# EAGLE design noisemaker_4-0 (EAGLE 8.0.2)
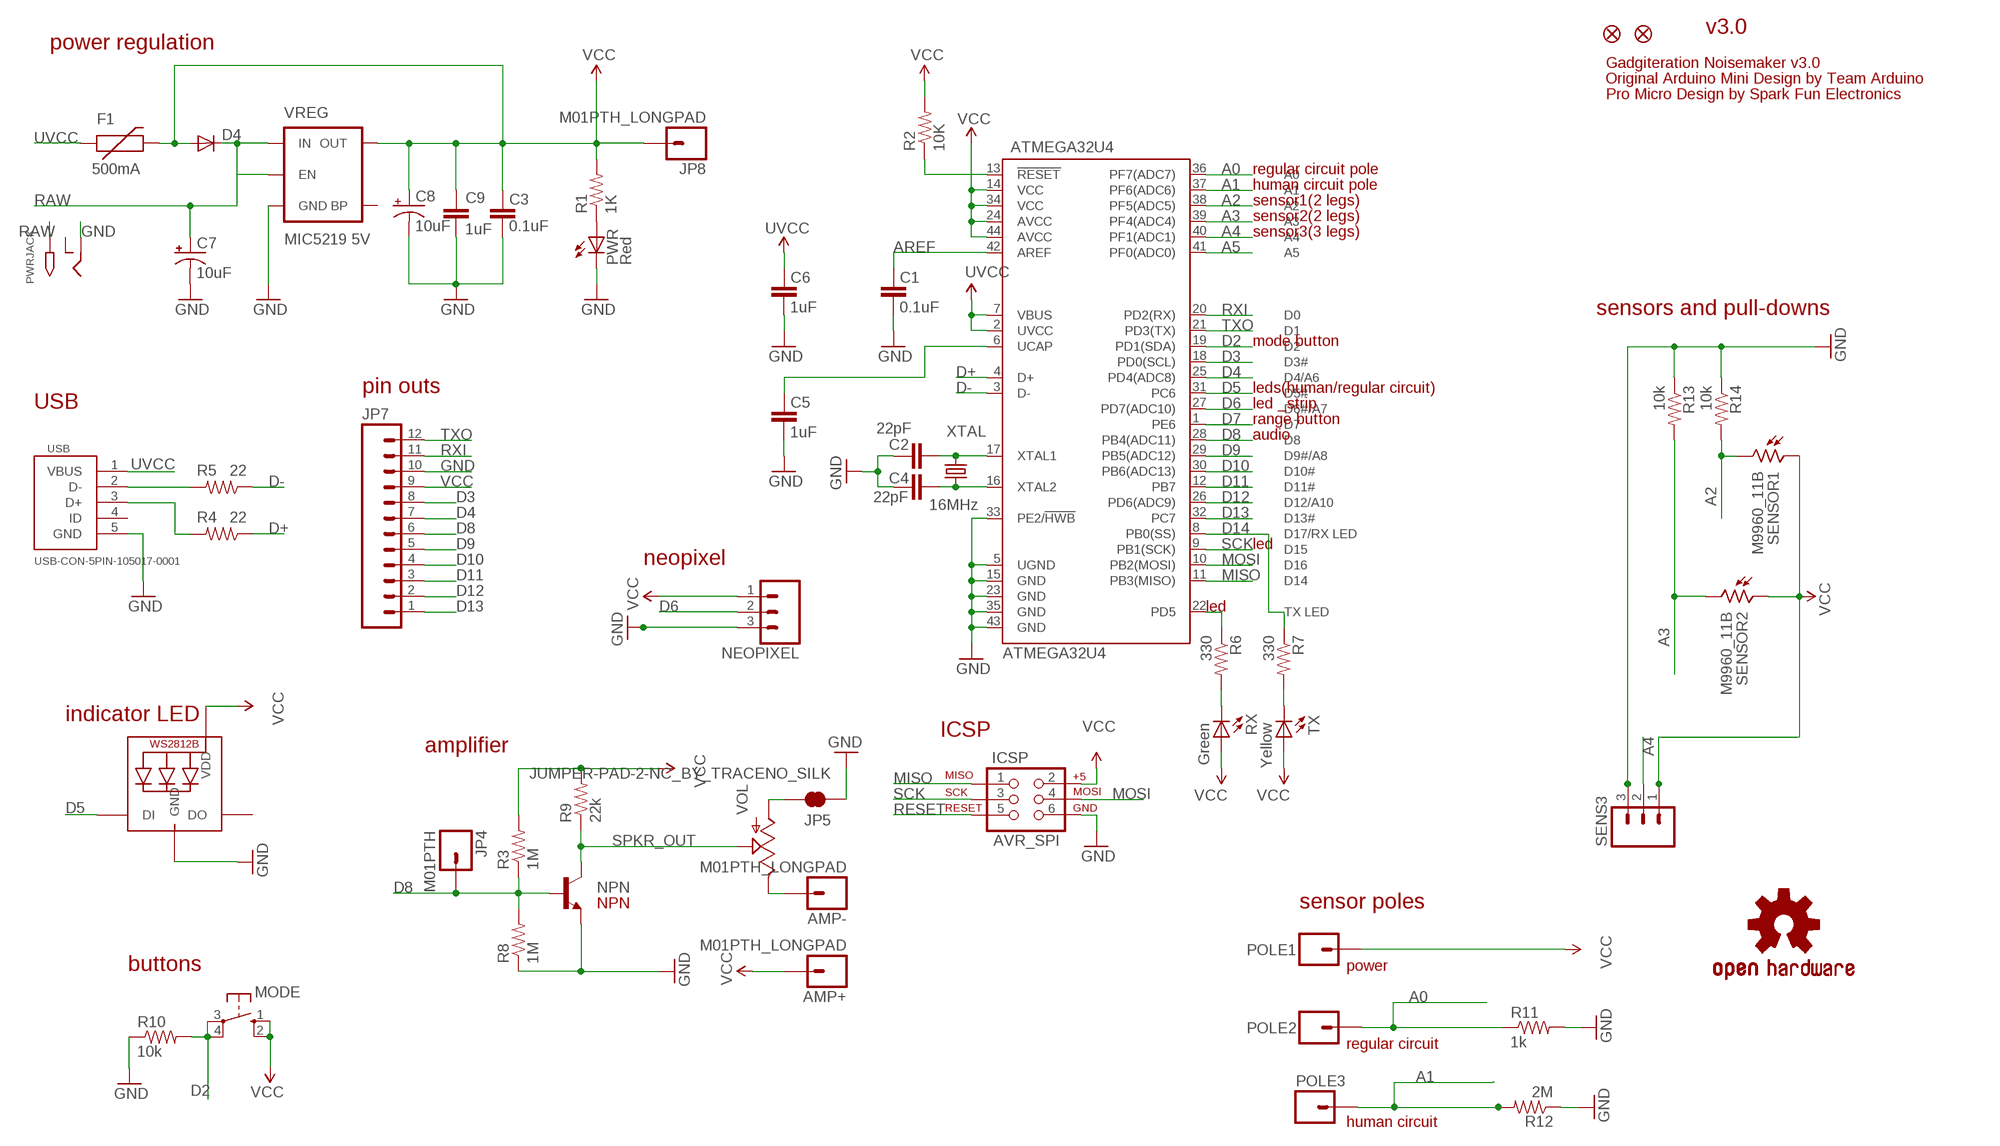
[diagram p0: schematic, sheet 1]

## Parts
AMP+  M01PTH_LONGPAD  [1X01_LONGPAD]
AMP-  M01PTH_LONGPAD  [1X01_LONGPAD]
ATMEGA32U4  ATMEGA32U4  ATMEGA32U4TQFP  [SPARKFUN-DIGITALIC_TQFP44]
C1  0.1uF  CAP1206  [1206]
C2  22pF  CAP0603-CAP  [0603-CAP]
C3  0.1uF  CAP1206  [1206]
C4  22pF  CAP0603-CAP  [0603-CAP]
C5  1uF  CAP1206  [1206]
C6  1uF  CAP1206  [1206]
C7  10uF  CAP_POL3528-KIT  [EIA3528-KIT]
C8  10uF  CAP_POL3528-KIT  [EIA3528-KIT]
C9  1uF  CAP1206  [1206]
D4  DIODESOD  [SOD-323]
F1  500mA  PTCSMD  [PTC-1206]
ICSP  AVR_SPI  AVR_SPI_PRG_6PTH  [2X3]
JP1  FIDUCIALUFIDUCIAL  [MICRO-FIDUCIAL]
JP2  FIDUCIALUFIDUCIAL  [MICRO-FIDUCIAL]
JP4  M01PTH  [1X01]
JP5  JUMPER-PAD-2-NC_BY_TRACENO_SILK  [PAD-JUMPER-2-NC_BY_TRACE_NO_SILK]
JP7  M12PTH  [1X12]
JP8  M01PTH_LONGPAD  [1X01_LONGPAD]
LED1  WS2812B3535  [LED3535]
LOGO1  OSHW-LOGOM  [OSHW-LOGO-M]
MODE  10-XX  [B3F-10XX]
NEOPIXEL  M03LONGPADS  [1X03_LONGPADS]
NPN  TRANSISTOR_NPNSOT23-3  [SOT23-3]
POLE1  M01ALLIGATOR-3MM  [1X01_ALLIGATOR_3MM]
POLE2  M01ALLIGATOR-3MM  [1X01_ALLIGATOR_3MM]
POLE3  M01PTH_LONGPAD  [1X01_LONGPAD]
PWR  Red  LEDCHIPLED_1206  [CHIPLED_1206]
PWRJACK  2.1MMJACKTHM  [PJ-102A]
R1  1K  RESISTOR1206  [1206]
R2  10K  RESISTOR1206  [1206]
R3  1M  RESISTOR1206  [1206]
R4  22  RESISTOR1206  [1206]
R5  22  RESISTOR1206  [1206]
R6  330  RESISTOR1206  [1206]
R7  330  RESISTOR1206  [1206]
R8  1M  RESISTOR1206  [1206]
R9  22k  RESISTOR1206  [1206]
R10  10k  RESISTOR1206  [1206]
R11  1k  RESISTOR1206  [1206]
R12  2M  RESISTOR1206  [1206]
R13  10k  RESISTOR1206  [1206]
R14  10k  RESISTOR1206  [1206]
RX  Green  LEDCHIPLED_1206  [CHIPLED_1206]
SENS3  M03POGO_PIN_HOLES_ONLY  [1X03_PP_HOLES_ONLY]
SENSOR1  M9960_11B  [M9960]
SENSOR2  M9960_11B  [M9960]
TX  Yellow  LEDCHIPLED_1206  [CHIPLED_1206]
USB  USB-CON-5PIN-105017-0001  [USB-MICRO-MOLEX-105017-0001]
VOL  POT  [ALPS_POT]
VREG  MIC5219 5V  V_REG_MIC52195V  [SOT23-5]
XTAL  16MHz  CRYSTAL5X3  [CRYSTAL-SMD-5X3]

## Nets
3.3V: LED1.2(VDD) ; supply symbol labelled VCC
A0: ATMEGA32U4.36(PF7(ADC7)) POLE2.1@0 POLE2.1@2 R11.1
A1: ATMEGA32U4.37(PF6(ADC6)) POLE3.1 R12.2
A2: ATMEGA32U4.38(PF5(ADC5)) R14.2 SENSOR1.2
A3: ATMEGA32U4.39(PF4(ADC4)) R13.2 SENSOR2.2
A4: ATMEGA32U4.40(PF1(ADC1)) SENS3.2
A5: ATMEGA32U4.41(PF0(ADC0))
AREF: ATMEGA32U4.42(AREF) C1.2
D2: ATMEGA32U4.19(PD1(SDA)) MODE.3(P) MODE.4(P1) R10.2
D3: ATMEGA32U4.18(PD0(SCL)) JP7.8
D4: ATMEGA32U4.25(PD4(ADC8)) JP7.7
D5: ATMEGA32U4.31(PC6) LED1.1(DI)
D6: ATMEGA32U4.27(PD7(ADC10)) NEOPIXEL.2
D7: ATMEGA32U4.1(PE6)
D8: ATMEGA32U4.28(PB4(ADC11)) JP4.1 JP7.6 NPN.1(B) R3.1 R8.2
D9: ATMEGA32U4.29(PB5(ADC12)) JP7.5
D10: ATMEGA32U4.30(PB6(ADC13)) JP7.4
D11: ATMEGA32U4.12(PB7) JP7.3
D12: ATMEGA32U4.26(PD6(ADC9)) JP7.2
D13: ATMEGA32U4.32(PC7) JP7.1
D14: ATMEGA32U4.8(PB0(SS)) R7.1
D+: ATMEGA32U4.4(D+) R4.1
D-: ATMEGA32U4.3(D-) R5.1
GND [vcc]: ATMEGA32U4.5(UGND) ATMEGA32U4.15(GND) ATMEGA32U4.23(GND) ATMEGA32U4.33(PE2/!HWB) ATMEGA32U4.35(GND) ATMEGA32U4.43(GND) C1.1 C2.2 C3.1 C4.2 C5.1 C6.1 C7.C(-) C8.C(-) C9.2 ICSP.6 JP5.1 JP7.10 LED1.4(GND) NEOPIXEL.3 NPN.2(E) PWR.C PWRJACK.RING R8.1 R10.1 R11.2 R12.1 R13.1 R14.1 SENS3.3 USB.5(GND) VREG.2(GND)
MISO: ATMEGA32U4.11(PB3(MISO)) ICSP.1
MOSI: ATMEGA32U4.10(PB2(MOSI)) ICSP.4
N$1: ATMEGA32U4.16(XTAL2) C4.1 XTAL.1
N$2: ATMEGA32U4.17(XTAL1) C2.1 XTAL.3
N$3: AMP-.1 VOL.P$1(E)
N$4: ATMEGA32U4.6(UCAP) C5.2
N$5: R7.2 TX.C
N$6: JP5.2 VOL.P$3(A)
N$7: R6.2 RX.C
N$10: PWR.A R1.1
N$11: R4.2 USB.3(D+)
N$14: R5.2 USB.2(D-)
RAW [vcc]: C7.A(+) D4.1(C) PWRJACK.TIP VREG.1(IN) VREG.3(EN)
RESET: ATMEGA32U4.13(!RESET) ICSP.5 R2.1
RXI: ATMEGA32U4.20(PD2(RX)) JP7.11
SCK: ATMEGA32U4.9(PB1(SCK)) ICSP.3
SPKR_OUT: NPN.3(C) R9.1 VOL.P$2(S)
TXLED: ATMEGA32U4.22(PD5) R6.1
TXO: ATMEGA32U4.21(PD3(TX)) JP7.12
UVCC: ATMEGA32U4.2(UVCC) ATMEGA32U4.7(VBUS) C6.2 F1.1 USB.1(VBUS)
VCC: AMP+.1 ATMEGA32U4.14(VCC) ATMEGA32U4.24(AVCC) ATMEGA32U4.34(VCC) ATMEGA32U4.44(AVCC) C3.2 C8.A(+) C9.1 D4.2(A) F1.2 ICSP.2 JP7.9 JP8.1 MODE.1(S) MODE.2(S1) NEOPIXEL.1 POLE1.1@0 POLE1.1@2 R1.2 R2.2 R3.2 R9.2 RX.A SENS3.1 SENSOR1.1 SENSOR2.1 TX.A VREG.5(OUT)
Unconnected: LED1.3(DO) PWRJACK.RING_SW USB.4(ID) VREG.4(BP)

## Notes on the sheet
- v3.0
- power regulation
- Gadgiteration Noisemaker v3.0
- Original Arduino Mini Design by Team Arduino
- Pro Micro Design by Spark Fun Electronics
- regular circuit pole
- human circuit pole
- sensor1(2 legs)
- sensor2(2 legs)
- sensor3(3 legs)
- sensors and pull-downs
- mode button
- pin outs | leds(human/regular circuit)
- USB | led _strip
- range button
- audio
- led
- neopixel
- led
- indicator LED
- ICSP
- amplifier
- NPN | sensor poles
- buttons | power
- regular circuit
- human circuit

## Library data of the parts
AMP+ AMP- JP4 JP8 POLE1-POLE3 = SparkFun-Connectors:M01: Header 1 Standard 1-pin 0.1" header. Use with straight break away headers (SKU : PRT-00116), right angle break away headers (PRT-00553), swiss pins (PRT-00743), machine pins (PRT-00117), and female headers (PRT-00115).
ATMEGA32U4 = SparkFun-DigitalIC:ATMEGA32U4: Atmel 44-pin 8-bit Microcontroller with 32KBytes of ISP Flash and USB Controller
C1 C3 C5 C6 C9 = SparkFun-Capacitors:CAP: Capacitor Standard 0603 ceramic capacitor, and 0.1" leaded capacitor.
C2 C4 = SparkFun:CAP: Capacitor Standard 0603 ceramic capacitor, and 0.1" leaded capacitor.
C7 C8 = SparkFun-Capacitors:CAP_POL: Capacitor Polarized These are standard SMD and PTH capacitors. Normally 10uF, 47uF, and 100uF in electrolytic and tantalum varieties. Always verify the external diameter of the through hole cap, it varies with capacity, voltage, and manufacturer. The EIA devices should be standard.
D4 = SparkFun:DIODE: Diode These are standard reverse protection diodes and small signal diodes. SMA package can handle up to about 1A. SOD-323 can handle about 200mA. What the SOD-323 package when ordering, there are some mfgs out there that are 5-pin packages.
F1 = SparkFun:PTC: Resettable Fuse PTC Resettable Fuse. Spark Fun Electronics SKU : COM-08357
ICSP = SparkFun:AVR_SPI_PRG_6: AVR ISP 6 Pin This is the reduced ISP connector for AVR programming. Common on Arduino. This footprint will take up less PCB space and can be used with a 10-pin to 6-pin adapter such as SKU: BOB-08508
JP1 JP2 = SparkFun:FIDUCIAL: Fiducial Alignment Points Various fiducial points for machine vision alignment.
JP5 = SparkFun-Passives:JUMPER-PAD-2-NC_BY_TRACE
JP7 = SparkFun:M12: Header 12 Standard 12-pin 0.1" header. Use with straight break away headers (SKU : PRT-00116), right angle break away headers (PRT-00553), swiss pins (PRT-00743), machine pins (PRT-00117), and female headers (PRT-00115).
LED1 = adafruit:WS2812B
LOGO1 = SparkFun-Aesthetics:OSHW-LOGO: Open Source Hardware Logo This logo indicates the piece of hardware it is found on incorporates a OSHW license and/or adheres to the definition of open source hardware found here: http://freedomdefined.org/OSHW
MODE = switch-omron:10-XX: OMRON SWITCH
NEOPIXEL SENS3 = SparkFun-Connectors:M03: Header 3 Standard 3-pin 0.1" header. Use with straight break away headers (SKU : PRT-00116), right angle break away headers (PRT-00553), swiss pins (PRT-00743), machine pins (PRT-00117), and female headers (PRT-00115). Molex polarized connector foot print use with SKU : PRT-08232 with associated crimp pins and housings.
NPN = SparkFun-DiscreteSemi:TRANSISTOR_NPN: Generic NPN BJT. MMBT2222 is the common NPN we use. Double check against datasheet- not all devices are the same!
PWR RX TX = adafruit:LED: LED OSRAM: - CHIPLED LG R971, LG N971, LY N971, LG Q971, LY Q971, LO R971, LY R971 LH N974, LH R974 LS Q976, LO Q976, LY Q976 LO Q996 - Hyper CHIPLED LW Q18S LB Q993, LB Q99A, LB R99A - SideLED LS A670, LO A670, LY A670, LG A670, LP A670 LB A673, LV A673, LT A673, LW A673 LH A674 LY A675 LS A676, LA A676, LO A676, LY A676, LW A676 LS A679, LY A679, LG A679 - Hyper Micro SIDELED® LS Y876, LA Y876, LO Y876, LY Y876 LT Y87S - SmartLED LW L88C, LW L88S LB L89C, LB L89S, LG L890 LS L89K, LO L89K, LY L89K LS L896, LA L896, LO L896, LY L896 - TOPLED LS T670, LO T670, LY T670, LG T670, LP T670 LSG T670, LSP T670, LSY T670, LOP T670, LYG T670 LG T671, LOG T671, LSG T671 LB T673, LV T673, LT T673, LW T673 LH T674 LS T676, LA T676, LO T676, LY T676, LB T676, LH T676, LSB T676, LW T676 LB T67C, LV T67C, LT T67C, LS T67K, LO T67K, LY T67K, LW E67C LS E67B, LA E67B, LO E67B, LY E67B, LB E67C, LV E67C, LT E67C LW T67C LS T679, LY T679, LG T679 LS T770, LO T770, LY T770, LG T770, LP T770 LB T773, LV T773, LT T773, LW T773 LH T774 LS E675, LA E675, LY E675, LS T675 LS T776, LA T776, LO T776, LY T776, LB T776 LHGB T686 LT T68C, LB T68C - Hyper Mini TOPLED® LB M676 - Mini TOPLED Santana® LG M470 LS M47K, LO M47K, LY M47K Source: http://www.osram.convergy.de/
PWRJACK = adafruit:2.1MMJACK: 2.1mm x 5.5mm THM DC jack with internal switch. Digikey part #PJ-102A, 4UCON part #05537 2.1mm x 5.5mm SMT DC jack with internal switch. Digikey part #PJ-002A-SMT, 4UCON part #03267 By microbuilder.eu & adafruit.com
R1-R14 = SparkFun-Passives:RESISTOR: Resistor Basic schematic elements and footprints for 0603, 1206, and PTH resistors.
SENSOR1 SENSOR2 = photo-elements:M9960_11: Photo Sensor Beacon Light, Photometer Applications Source: http://optoelectronics.perkinelmer.com/content/Datasheets/DTS_M9960.pdf
USB = GeekAmmo:USB-CON-5PIN: Molex Micro USB 105017-0001
VOL = SparkFun-Electromechanical:POT; PROD_ID: RES-09177
VREG = SparkFun-PowerIC:V_REG_MIC5219: V_REG MIC5219 Standard 3.3V and 5V 500mA LDO voltage regulator in SOT-23 layout. Micrel part MIC5219. BP (by-pass) pin is used to lower output noise with 470pF cap, may be left open.; PROD_ID: VREG-10107
XTAL = SparkFun:CRYSTAL: Crystals Various standard crystals. Proven footprints. Spark Fun Electronics SKU : COM-00534

## Net classes
0 default: width 0.203 mm

## Board
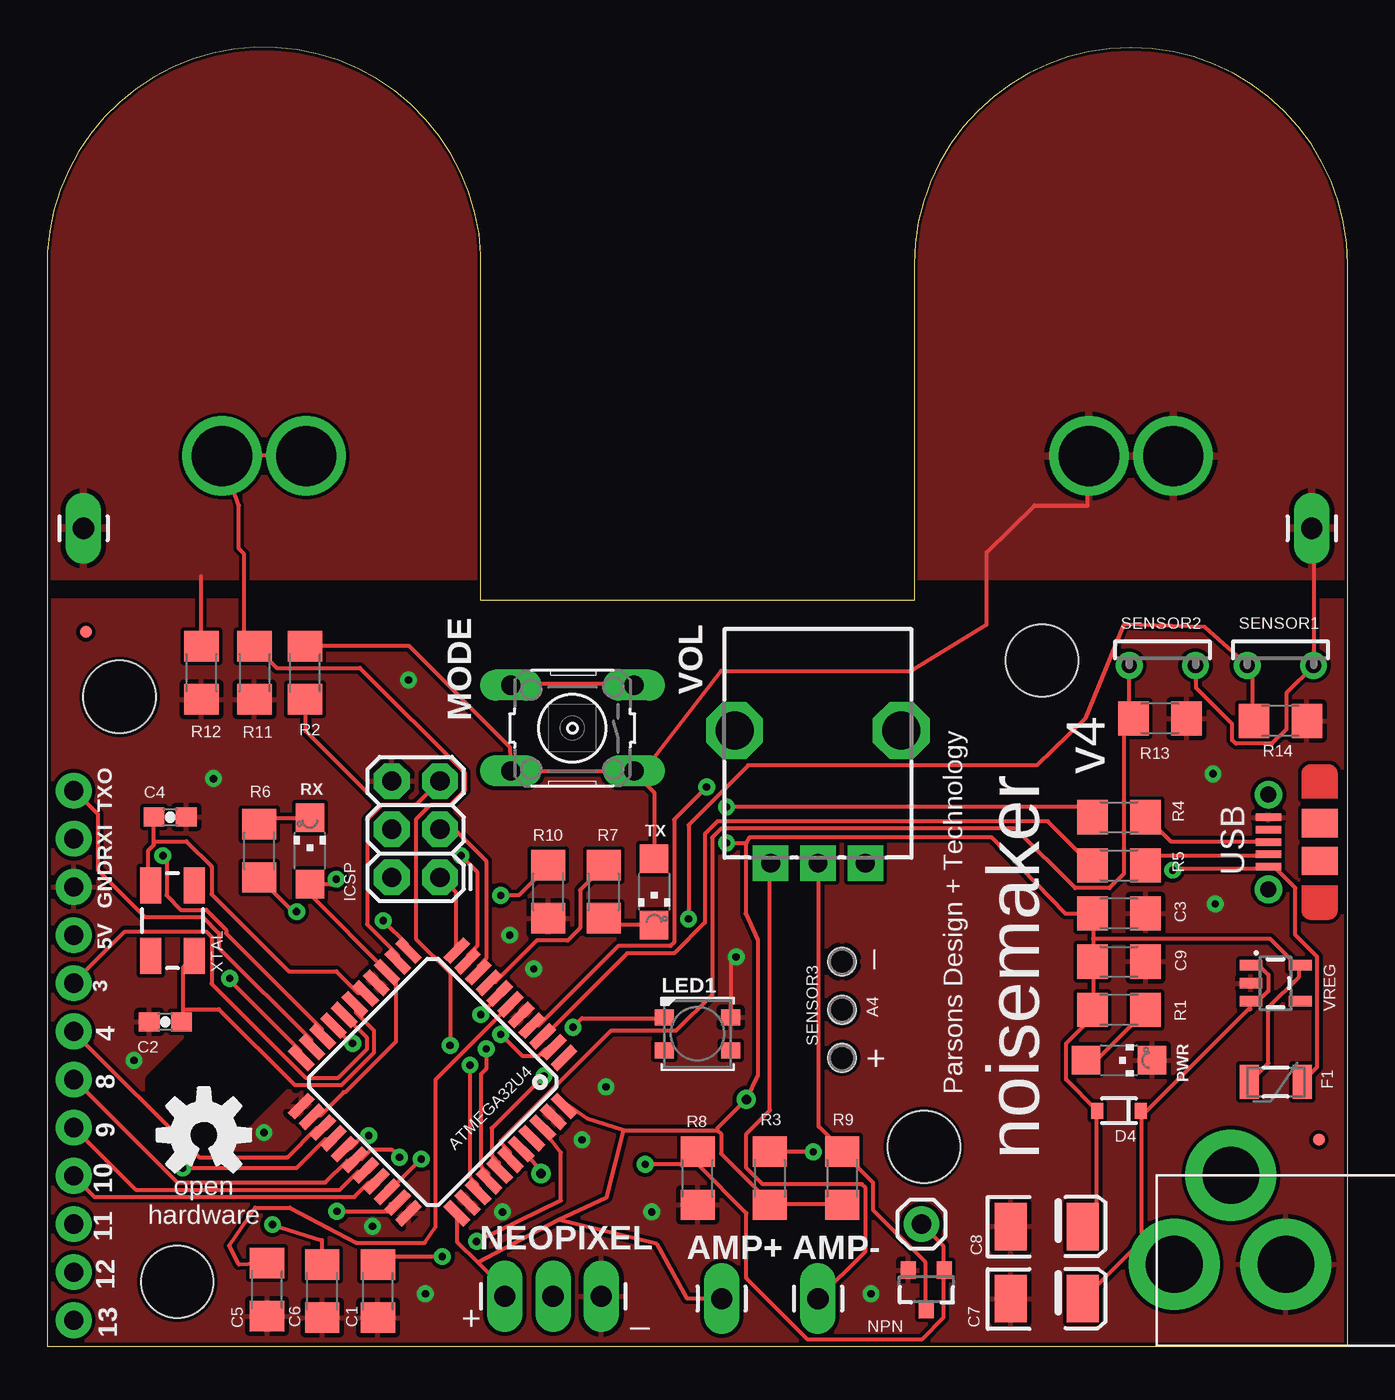
[diagram p1: board, top side]
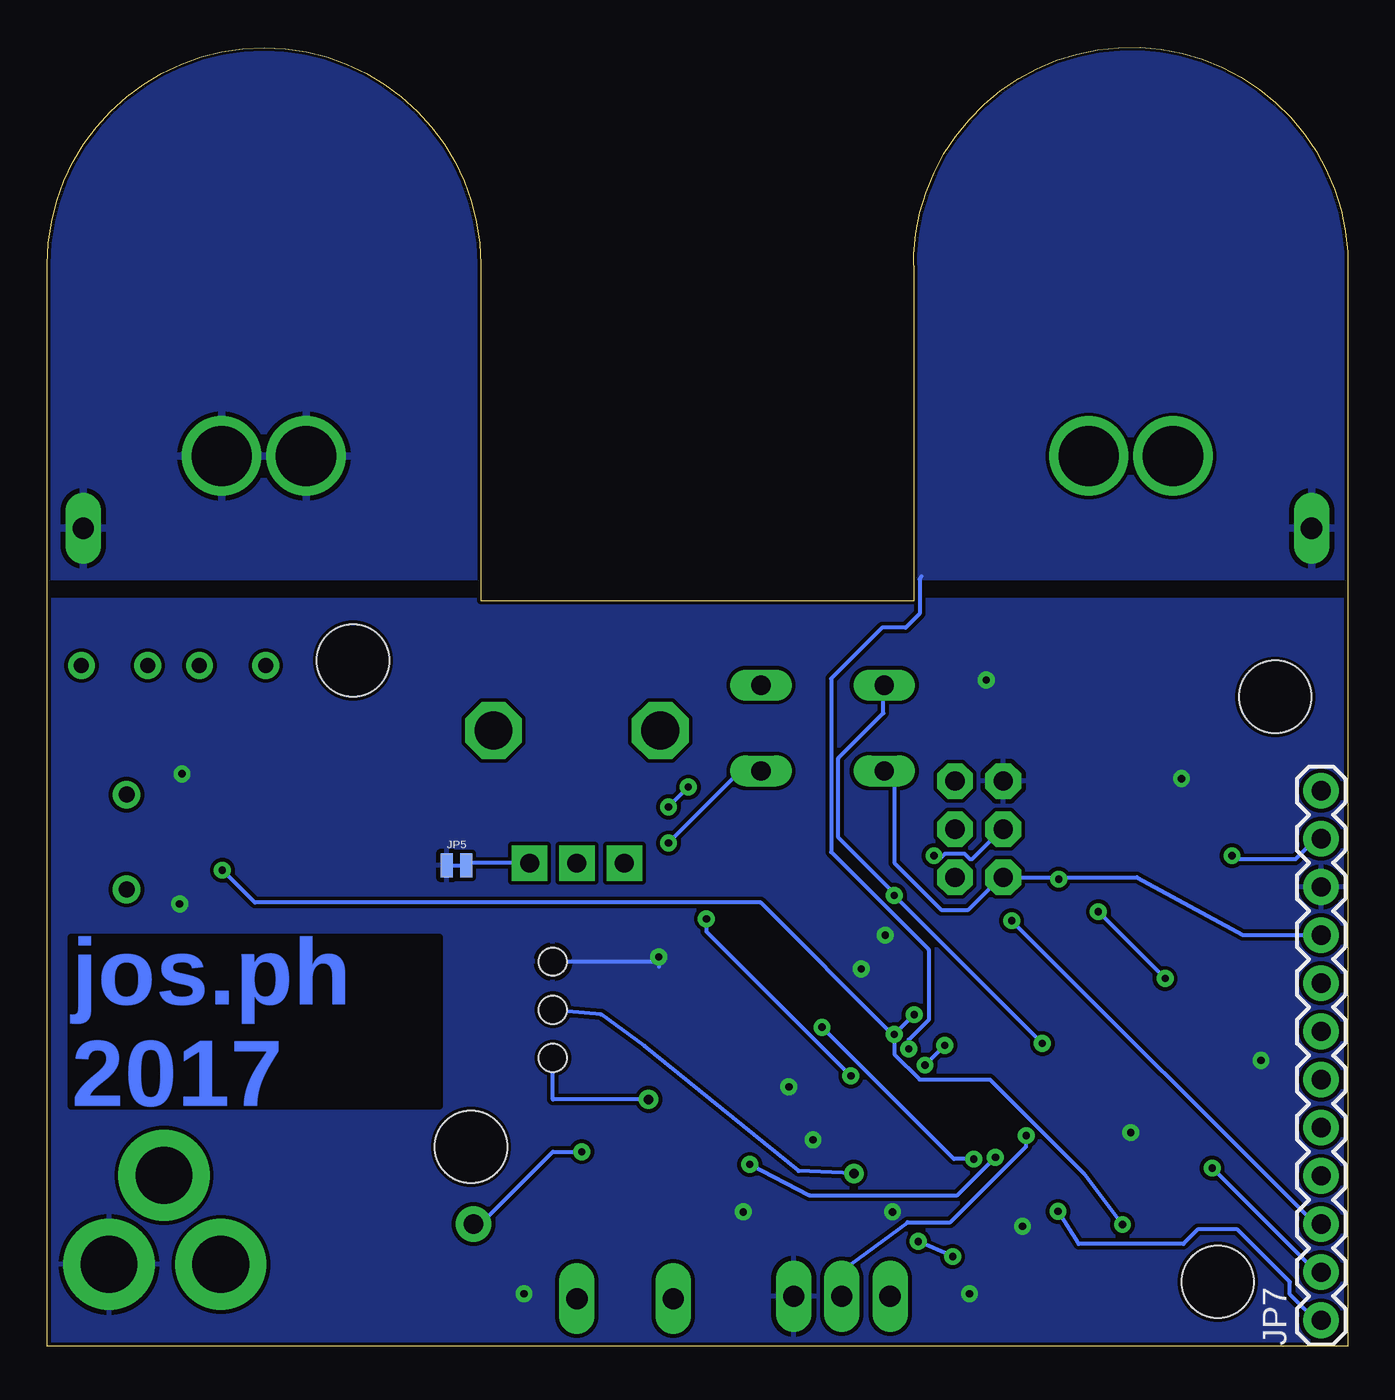
[diagram p2: board, bottom side, seen from below]

Size 68.56 x 68.51 mm. Coordinates in mm from the lower left corner, seen from the top.
Outline: 0,0 68.56,0 68.56,57.07 arc180 45.71,57.07 45.71,39.33 22.86,39.33 22.86,56.44 arc180 0,57.71 0,0
Copper layers (1*16): Top 0.035mm / dielectric 1.5mm / Bottom 0.035mm
Design rules "SparkFun *": minimum track width 8mil, minimum drill 15mil, track to track 7mil, track to pad 7mil, pad to pad 7mil, via to via 7mil, smd to smd 7mil, copper to edge 7mil, drill to drill 7mil, minimum pad ring 12mil, minimum via ring 10mil, stop-mask expansion 4mil, vias tented up to drill 20mil, thermal gap 10mil
Holes 3.81 mm at 3.81,34.25 46.22,10.5 52.45,36.16 6.85,3.39
tRestrict: area 9.1,9.6 to 9.3,9.7; area 13.1,13.6 to 13.1,13.6; area 5.4,10.2 to 12.6,17.5

### Footprints (pad centres in the part's own frame; a part is rotated, then mirrored left to right if it is on the bottom)
1X01_LONGPAD = drill 1.118 pad 1.88 long: 1 0,0
SPARKFUN-DIGITALIC_TQFP44 = smd 1.5 x 0.5: 1 -5.8,4; 2 -5.8,3.2; 3 -5.8,2.4; 4 -5.8,1.6; 5 -5.8,0.8; 6 -5.8,0; 7 -5.8,-0.8; 8 -5.8,-1.6; 9 -5.8,-2.4; 10 -5.8,-3.2; 11 -5.8,-4; 23 5.8,-4; 24 5.8,-3.2; 25 5.8,-2.4; 26 5.8,-1.6; 27 5.8,-0.8; 28 5.8,0; 29 5.8,0.8; 30 5.8,1.6; 31 5.8,2.4; 32 5.8,3.2; 33 5.8,4 | smd 0.5 x 1.5: 12 -4,-5.8; 13 -3.2,-5.8; 14 -2.4,-5.8; 15 -1.6,-5.8; 16 -0.8,-5.8; 17 0,-5.8; 18 0.8,-5.8; 19 1.6,-5.8; 20 2.4,-5.8; 21 3.2,-5.8; 22 4,-5.8; 34 4,5.8; 35 3.2,5.8; 36 2.4,5.8; 37 1.6,5.8; 38 0.8,5.8; 39 0,5.8; 40 -0.8,5.8; 41 -1.6,5.8; 42 -2.4,5.8; 43 -3.2,5.8; 44 -4,5.8
1206 = smd 1.6 x 1.8: 1 -1.4,0; 2 1.4,0
0603-CAP = smd 1.1 x 1: 1 -0.85,0; 2 0.85,0
EIA3528-KIT = smd 1.7 x 2.5: A 1.9,0; C -1.9,0
SOD-323 = smd 0.63 x 0.83: 1 -1.15,0; 2 1.15,0
PTC-1206 = smd 1 x 1.8: 1 -1.4,0; 2 1.4,0
2X3 = drill 1.016 pad 1.88 octagon: 1 0,0; 2 0,2.54; 3 2.54,0; 4 2.54,2.54; 5 5.08,0; 6 5.08,2.54
MICRO-FIDUCIAL = smd 0.635 x 0.635: 1 0,0
1X01 = drill 1.016 pad 1.88: 1 0,0
PAD-JUMPER-2-NC_BY_TRACE_NO_SILK = smd 0.635 x 1.27: 1 -0.508,0; 2 0.508,0
1X12 = drill 1.016 pad 1.88: 1 0,0; 2 2.54,0; 3 5.08,0; 4 7.62,0; 5 10.16,0; 6 12.7,0; 7 15.24,0; 8 17.78,0; 9 20.32,0; 10 22.86,0; 11 25.4,0; 12 27.94,0
LED3535 = smd 1 x 0.85: 1 -1.75,0.875; 2 -1.75,-0.875; 3 1.75,-0.875; 4 1.75,0.875
B3F-10XX = drill 1.016 long: 1 -3.251,2.261; 2 3.251,2.261; 3 -3.251,-2.261; 4 3.251,-2.261
1X03_LONGPADS = drill 1.118 pad 1.88 long: 1 0,0; 2 2.54,0; 3 5.08,0
SOT23-3 = smd 0.8 x 0.9: 1 -0.95,-1; 2 0.95,-1; 3 0,1.1
1X01_ALLIGATOR_3MM = drill 3.175: 1@0 0,2.223; 1@2 0,-2.223
CHIPLED_1206 = smd 1.5 x 1.5: A 0,-1.75; C 0,1.75
PJ-102A = drill 3 pad 4.8: RING 0.1,-3.39; RING_SW -4.6,-6.29; TIP 0.1,-9.29
1X03_PP_HOLES_ONLY = drill 0.9 pad 0.813: 1 0,0; 2 2.54,0; 3 5.08,0 | hole 1.473: 0,0; 2.54,0; 5.08,0
M9960 = drill 0.8 pad 1.4: 1 -1.75,0; 2 1.75,0
USB-MICRO-MOLEX-105017-0001 = smd 0.4 x 1.35: 1 1.2,0; 2 1.85,0; 3 2.5,0; 4 3.15,0; 5 3.8,0 | drill 0.85 pad 1.45: P$1 0,0; P$2 5,0 | smd 1.5 x 1.9: P$3 3.5,-2.7; P$4 1.5,-2.7
ALPS_POT = drill 1 pad 1.88 square: P$1 7,-2.5; P$2 7,0; P$3 7,2.5 | drill 2 octagon: P$4 0,-4.4; P$5 0,4.4
SOT23-5 = smd 0.55 x 1.2: 1 -0.95,-1.3; 2 0,-1.3; 3 0.95,-1.3; 4 0.95,1.3; 5 -0.95,1.3
CRYSTAL-SMD-5X3 = smd 1.9 x 1.1: 1 -1.85,-1.15; 2 1.85,-1.15; 3 1.85,1.15; 4 -1.85,1.15

### Placement (x,y rotation side)
AMP+  35.55,2.5 0 top
AMP-  40.63,2.5 0 top
ATMEGA32U4  20.32,13.93 225 top
C1  17.43,2.9 90 top
C2  6.22,17.11 180 top
C3  56.51,22.82 180 top
C4  6.47,27.9 0 top
C5  11.58,2.98 90 top
C6  14.49,2.9 90 top
C7  52.7,2.5 0 top
C8  52.7,6.31 0 top
C9  56.51,20.28 0 top
D4  56.51,12.41 180 top
F1  64.77,13.93 180 top
ICSP  20.7,24.73 90 top
JP1  2.03,37.68 0 top
JP2  67.05,10.88 0 top
JP4  46.1,6.44 0 top
JP5  46.98,25.36 0 bottom
JP7  1.39,1.36 90 bottom
JP8  66.67,43.14 0 top
LED1  34.28,16.47 0 top
LOGO1  8.25,11.14 0 top
MODE  27.68,32.6 180 top
NEOPIXEL  24.12,2.63 0 top
NPN  46.35,3.01 180 top
POLE1  57.14,46.95 90 top
POLE2  11.42,46.95 90 top
POLE3  1.9,43.14 0 top
PWR  56.51,15.07 270 top
PWRJACK  68.7,4.41 270 top
R1  56.51,17.74 180 top
R2  13.58,35.52 90 top
R3  38.09,8.85 270 top
R4  56.51,27.9 0 top
R5  56.51,25.36 0 top
R6  11.17,26.12 90 top
R7  29.33,23.96 270 top
R8  34.28,8.85 90 top
R9  41.9,8.85 270 top
R10  26.41,23.96 90 top
R11  10.92,35.52 270 top
R12  8.12,35.52 90 top
R13  58.67,33.11 180 top
R14  65.02,32.98 180 top
RX  13.84,26.12 0 top
SENS3  41.9,15.2 90 top
SENSOR1  65.02,35.9 180 top
SENSOR2  58.8,35.9 180 top
TX  32,23.96 180 top
USB  64.38,24.09 90 top
VOL  40.63,32.47 270 top
VREG  64.77,19.14 270 top
XTAL  6.6,22.44 270 top

### Tracks (layer width: path | path; a pad name or v marks a point on that pad's centre or on a via)
A0  (via drill 0.38)
  Top 0.203: POLE2.1@2 13.62,46.98 9.23,46.98 POLE2.1@0 10.09,44.35 10.09,42.06 10.38,41.78 10.38,37.49 10.85,37.01 R11.1 10.95,36.92 12.09,35.78 16.47,35.78 22,30.25 22,29.3 21.24,28.54 20.19,28.54 19.43,27.77 19.43,21.49 21.24,19.68 v21.24,15.87 | v22.28,14.82 22.28,8.92 22.66,8.53 22.66,8.15 ATMEGA32U4.36
  Bottom 0.203: v21.24,15.87 v22.28,14.82
A1  (via drill 0.38)
  Top 0.203: v23.14,15.68 23.14,14.63 22.86,14.34 22.86,9.49 23.24,9.11 23.24,8.72 ATMEGA32U4.37 | 8.09,40.6 8.09,37.01 R12.2
  Bottom 0.203: v23.14,15.68 23.14,16.15 22.09,17.2 22.09,20.92 27.24,26.06 27.24,35.2 24.54,37.9 23.3,37.9 22.57,38.63 22.57,40.44 22.47,40.6
  pour Top: -3.81,71.08 26.67,71.08 26.67,40.6 -3.81,40.6
  pour Bottom: -5.08,69.81 27.94,69.81 27.94,40.6 -5.08,40.6
A2  (via drill 0.38)
  Top 0.203: v26.19,14.25 23.43,11.49 23.43,10.06 23.81,9.68 23.81,9.3 ATMEGA32U4.38 | v33.81,22.54 33.81,27.49 36.95,30.63 52.16,30.63 54.73,33.11 56.76,38.06 61.02,37.94 63.24,35.97 SENSOR1.2 63.34,35.87 63.53,35.68 63.53,33.01 R14.2
  Bottom 0.203: v26.19,14.25 33.81,21.87 v33.81,22.54
A3
  Top 0.203: ATMEGA32U4.39 24.38,9.87 24.38,10.25 23.9,10.72 23.9,10.82 29.71,16.63 33.14,16.63 35.05,18.54 35.05,26.82 35.52,27.3 51.05,27.3 54.19,24.16 56,24.16 56.76,24.92 56.76,32.63 57.24,33.11 R13.2 57.24,33.2 57.05,33.4 57.05,35.87 SENSOR2.2
A4  (via drill 0.51)
  Top 0.203: ATMEGA32U4.40 26.03,9.25 26.16,9.23 26.03,9.23 v26.03,9.11
  Bottom 0.203: v26.03,9.11 28.95,9.23 37.08,15.84 39.36,17.49 42.03,17.74 SENS3.2
AREF  (via drill 0.38)
  Top 0.203: v22.63,5.52 27.08,7.68 27.08,10.22 26.32,11.23 26.19,11.49 ATMEGA32U4.42 | v20.82,4.72 17.9,4.72 17.52,4.34 C1.2
  Bottom 0.203: v20.82,4.72 v22.63,5.52
D2  (via drill 0.38)
  Top 0.203: MODE.4 24.47,34.92 30.86,34.92 MODE.3 | v16.09,15.96 16,15.96 15.14,16.82 ATMEGA32U4.19 | v23.9,23.77 24.86,23.77 26.38,25.3 R10.2
  Bottom 0.203: v16.09,15.96 v23.9,23.77 23.9,23.87 26.86,26.82 26.86,31.01 24.47,33.4 24.47,34.82 MODE.4
D3
  Top 0.203: ATMEGA32U4.18 15.71,17.39 16.85,16.25 16.85,15.68 15.33,14.15 13.62,14.15 8.66,19.11 8.66,21.58 8.38,21.87 4.09,21.87 1.42,19.2 JP7.8
D4
  Top 0.203: ATMEGA32U4.25 14.47,11.49 14.19,11.49 12.66,9.96 8,9.96 1.42,16.54 JP7.7
D5  (via drill 0.38)
  Top 0.203: v27.71,16.82 28.19,17.3 32.47,17.3 LED1.1 | v19.71,9.87 18,8.15 ATMEGA32U4.31
  Bottom 0.203: v27.71,16.82 20.76,9.87 v19.71,9.87
D6  (via drill 0.38)
  Top 0.203: v16.95,11.11 16.66,11.11 16,10.44 15.71,10.44 ATMEGA32U4.27
  Bottom 0.203: v16.95,11.11 16.95,10.54 20.95,6.53 23.2,6.53 26.67,3.96 NEOPIXEL.2
D8  (via drill 0.38)
  Top 0.203: JP7.6 1.42,14.06 6.85,8.63 14.66,8.63 15.81,9.77 16.19,9.77 ATMEGA32U4.28 16.28,9.87 16.57,9.87 17.05,10.34 18.19,10.34 v18.57,9.96 | JP4.1 47.24,5.3 47.24,4.06 NPN.1 47.24,3.96 47.24,1.49 46.1,0.34 40.09,0.34 36.86,3.58 36.86,7.01 34.28,9.58 R8.2 34.19,9.58 v31.52,9.58 | v40.38,10.25 R3.1
  Bottom 0.203: v40.38,10.25 41.9,10.25 45.71,6.44 JP4.1 | v18.57,9.96 20.57,7.96 28.38,7.96 v31.52,9.58
D9
  Top 0.203: JP7.5 4.66,8.25 15.43,8.25 16.38,9.2 16.76,9.2 ATMEGA32U4.29
D10
  Top 0.203: ATMEGA32U4.30 17.33,8.63 16.95,8.63 16.19,7.87 2.47,7.87 1.42,8.92 JP7.4
D11  (via drill 0.38)
  Top 0.203: v17.71,22.44 18.95,21.2 18.95,20.92 ATMEGA32U4.12
  Bottom 0.203: v17.71,22.44 1.71,6.44 JP7.3
D12  (via drill 0.38)
  Top 0.203: v7.14,9.39 13.14,9.39 14.66,10.92 15.04,10.92 ATMEGA32U4.26
  Bottom 0.203: v7.14,9.39 1.71,3.96 1.42,3.96 JP7.2
D13  (via drill 0.38)
  Top 0.203: v15.27,7.11 17.97,7.11 18.09,7.49 18.47,7.49 ATMEGA32U4.32
  Bottom 0.203: v15.27,7.11 14.19,5.39 8.66,5.39 7.9,6.15 5.8,6.15 3.04,3.39 3.04,2.72 1.71,1.39 1.42,1.39 JP7.1
D14
  Top 0.203: ATMEGA32U4.8 23.33,19.2 23.62,19.2 25.81,21.39 27.43,21.39 28.09,22.06 28.09,24.06 29.33,25.3 R7.1
D+  (via drill 0.38)
  Top 0.203: v34.76,29.49 33.05,27.77 33.05,21.3 32.86,21.11 30.09,21.11 25.9,16.92 25.62,16.92 ATMEGA32U4.4 | v35.81,28.44 54.57,28.44 55.05,27.96 R4.1
  Bottom 0.203: v35.81,28.44 v34.76,29.49
D-
  Top 0.203: ATMEGA32U4.3 26.19,16.34 30.57,20.73 33.05,20.73 34.67,22.35 34.67,27.01 35.33,27.68 52.76,27.68 55.05,25.39 R5.1
GND  (via drill 0.38)
  Top 0.203: ATMEGA32U4.15 17.33,19.2 17.32,19.19 | v36.32,20.54 36.03,20.54 LED1.4
  Bottom 0.203: JP7.10 1.42,24.25 1.52,24.25 | SENS3.3 36.32,20.28 | 36.32,20.28 36.32,20.03 | 36.32,20.28 v36.32,20.54
  other vias: 4.57,15.07 11.42,11.27 8.76,29.93 25.65,19.9 24.38,21.68 19.05,35.14 19.93,2.76 17.14,6.31 24,7.07 28.19,10.88 29.46,13.68 61.59,23.33 61.46,30.19 43.43,2.76 31.87,7.07
  pour Top (isolate 0.203): -3.81,39.33 83.81,39.33 83.81,-3.85 -3.81,-2.58
  pour Bottom (isolate 0.203): -5.21,39.33 86.23,39.33 85.09,-1.31 -5.08,-1.31
MISO
  Top 0.203: ATMEGA32U4.11 21.52,20.92 21.52,23.96 20.76,24.73 ICSP.1
MOSI  (via drill 0.38)
  Top 0.203: v21.81,25.87 22.66,25.01 22.66,21.11 22.19,20.63 22.19,20.35 ATMEGA32U4.10
  Bottom 0.203: v21.81,25.87 21.62,25.68 21.52,25.68 21.24,25.96 20.19,25.96 19.9,25.68 19.81,25.68 18.19,27.3 ICSP.4
N$1
  Top 0.203: 5.62,26.63 5.62,26.44 5.33,26.16 5.33,24.44 5.42,24.35 XTAL.1 | 5.62,26.63 5.62,27.87 C4.1 | 5.62,26.63 7.33,26.63 8.66,25.3 8.66,23.84 12.73,19.77 15.23,19.77 16.38,18.63 16.76,18.63 ATMEGA32U4.16
N$2
  Top 0.203: 7.14,17.77 7.14,19.96 7.71,20.54 XTAL.3 | 7.14,17.77 7.14,17.11 C2.1 | 7.14,17.77 9.04,17.77 13.04,13.77 15.52,13.77 17.23,15.49 17.23,16.63 16.28,17.58 16.28,17.96 ATMEGA32U4.17
N$3
  Top 0.203: AMP-.1 43.14,5.01 43.14,8.34 42.95,8.53 37.71,8.53 36.86,9.39 36.86,11.2 38.09,12.44 38.09,25.39 VOL.P$1
N$4
  Top 0.203: ATMEGA32U4.6 24.38,17.96 20.47,14.06 20.47,6.28 19.9,5.46 16.28,5.46 12.79,7.3 10.95,7.3 9.58,5.3 10.09,4.31 C5.2
N$5
  Top 0.203: TX.C 32,22.25 29.62,22.25 29.33,22.54 R7.2
N$6
  Bottom 0.203: VOL.P$3 46.48,25.47 JP5.2
N$7
  Top 0.203: RX.C 13.81,27.87 11.52,27.87 11.23,27.58 R6.2
N$10
  Top 0.203: PWR.A 54.76,15.11 55.34,15.11 57.91,17.68 R1.1
N$11
  Top 0.203: USB.3 64.38,26.63 59.24,26.63 58,27.87 R4.2
N$14
  Top 0.203: USB.2 64.38,25.87 58.48,25.87 58,25.39 R5.2
RAW
  Top 0.203: VREG.1 63.53,20.06 63.91,20.06 64.38,19.58 64.38,18.73 63.91,18.25 63.53,18.25 VREG.3 63.43,18.16 63.43,17.77 63.34,17.77 57.81,12.25 D4.1 | 57.91,5.77 59.34,4.34 PWRJACK.TIP 57.91,5.77 | 57.91,5.77 57.72,5.96 57.72,12.34 D4.1 | 57.81,12.15 D4.1 | 57.91,5.77 54.67,2.53 C7.A
RESET
  Top 0.203: 17.57,28.49 17.62,28.54 19.43,28.54 ICSP.5 | 17.57,28.49 16.85,27.77 16.85,22.25 18.47,20.63 18.47,20.35 ATMEGA32U4.13 | 17.57,28.49 13.62,32.44 13.62,34.06 R2.1
RXI  (via drill 0.38)
  Top 0.203: v6.09,25.87 6.28,25.68 6.28,23.77 7.04,23.01 8.38,23.01 9.42,21.96 9.42,21.77 14.47,16.73 14.47,16.34 ATMEGA32U4.20
  Bottom 0.203: v6.09,25.87 5.9,25.68 2.76,25.68 1.71,26.73 1.42,26.73 JP7.11
SCK
  Top 0.203: ATMEGA32U4.9 22.76,19.77 22.76,20.06 23.14,20.44 23.14,25.58 21.52,27.2 20.76,27.2 ICSP.3
SPKR_OUT
  Top 0.203: NPN.3 46.29,1.96 46.29,4.44 43.52,7.2 43.52,8.63 R9.1 41.9,10.34 40.67,11.58 40.67,25.39 VOL.P$2
TXLED  (via drill 0.38)
  Top 0.203: v9.61,19.39 9.61,19.3 13.33,15.58 13.33,15.3 ATMEGA32U4.22 | v13.14,22.92 12.95,22.92 11.23,24.63 R6.1
  Bottom 0.203: v13.14,22.92 v9.61,19.39
TXO
  Top 0.203: ATMEGA32U4.21 13.9,15.77 13.9,16.15 9.04,21.01 9.04,21.77 8.19,22.63 5.14,22.63 2.66,25.11 2.66,28.06 1.42,29.3 JP7.12
UVCC  (via drill 0.38)
  Top 0.203: F1.1 66.19,13.96 66.96,14.73 66.96,20.54 65.81,21.68 65.81,24.16 64.77,25.2 64.38,25.2 USB.1 64.29,25.2 59.43,25.2 v59.34,25.11 | v23.9,16.44 25.05,15.3 25.9,15.3 26.28,15.68 26.67,15.68 ATMEGA32U4.2 | v22.86,17.49 23.9,18.54 ATMEGA32U4.7 | v11.87,6.41 14.47,5.58 14.47,4.34 C6.2
  Bottom 0.203: v22.86,17.49 v23.9,16.44 | v11.87,6.41 13.9,9.11 18.86,14.06 22.57,14.06 23.9,15.39 v23.9,16.44 | v59.34,25.11 57.62,23.39 30.95,23.39 24,16.44 v23.9,16.44
VCC  (via drill 0.38, 0.51)
  Top 0.203: C8.A 54.67,6.34 55.34,7.01 55.34,12.34 D4.2 55.34,12.44 53.72,14.06 53.72,15.96 55.05,17.3 55.05,17.68 R1.2 55.14,17.77 55.14,20.25 C9.1 | 55.14,21.49 55.14,22.82 C3.2 53.68,22.82 49.78,26.85 37.05,26.85 36.86,26.54 36.82,26.54 | 55.14,21.49 55.14,20.35 C9.1 | 55.24,20.44 C9.1 | R9.2 41.9,7.49 38.09,7.49 R3.2 38.09,7.58 35.52,10.15 35.52,11.2 35.33,11.39 | 22.68,4.42 24.09,3.01 24.09,2.63 NEOPIXEL.1 | 22.68,4.42 21.62,5.49 21.62,6.92 ATMEGA32U4.34 | 30.38,11.39 29.49,7.84 26.95,6.66 | 30.38,11.39 28.48,11.99 27.21,12.88 27.33,12.63 ATMEGA32U4.44 | 22.68,4.42 26.95,6.66 | 30.38,11.39 35.33,11.39 | AMP+.1 35.52,2.53 33.71,2.53 32.13,5.39 26.95,6.66 | 36.82,26.54 36.82,22.82 37.46,21.43 37.46,14.28 v36.86,13.01 35.33,11.49 35.33,11.39 | ATMEGA32U4.24 14,12.15 14.38,12.15 15.62,13.39 15.71,13.39 18.38,16.06 18.38,19.3 18,19.68 ATMEGA32U4.14 17.9,19.77 13.9,23.77 13.9,24.35 RX.A 14,24.35 14.95,24.35 v15.23,24.63 | SENSOR2.1 60.57,35.87 60.57,34.73 62.48,32.82 62.48,31.97 62.67,31.78 64.57,31.78 65.34,32.54 65.34,34.44 66.77,35.87 SENSOR1.1 66.77,35.97 66.77,43.02 66.67,43.11 JP8.1 | TX.A 32,29.2 30.95,30.25 MODE.1 | R2.2 13.62,36.92 19.08,36.92 24.38,31.62 MODE.2 24.47,30.35 30.86,30.35 MODE.1 | POLE1.1@0 54.86,44.35 52.06,44.35 49.52,41.87 49.52,38.06 45.52,35.62 35.52,35.62 31.24,30.06 MODE.1 | v35.81,26.54 36.82,26.54 | F1.2 63.43,13.96 64.38,14.92 64.38,17.87 66,19.49 66,20.06 VREG.5 65.91,20.06 64.48,21.49 55.14,21.49
  Bottom 0.203: JP7.9 5.52,21.68 11.11,24.73 15.23,24.73 | 15.23,24.73 ICSP.2 18.19,24.63 18.38,24.63 20,23.01 21.43,23.01 23.9,25.49 23.9,29.77 24.38,30.25 MODE.2 | v15.23,24.63 15.23,24.73 | v35.81,26.54 32.09,30.25 30.95,30.25 MODE.1 | v36.86,13.01 41.9,13.01 SENS3.1
  pour Bottom: 49.52,69.81 76.2,69.81 76.2,40.6 40.51,40.6 40.51,53.05 40.63,69.56
  pour Top: 39.36,70.45 73.66,70.45 73.66,40.6 39.36,40.6

### Text on the board
Bottom: jos.ph / 2017
tPlace: TXO | RXI | GND | 5V | 3 | 4 | 8 | 9 | 10 | 11 | 12 | 13
tNames: VOL | v4 | USB | _ | A4 | SENSOR3 | + | Parsons Design + Technology | noisemaker | open / hardware | _ | +
tValues: Valid combinations: | 3.3V Reg / 8MHz | 5V Reg / 16MHz | Mark back accordingly